# EAGLE schematic ide-8bit (EAGLE 9.4.2)

## Sheet 1 of 3: Bus interface
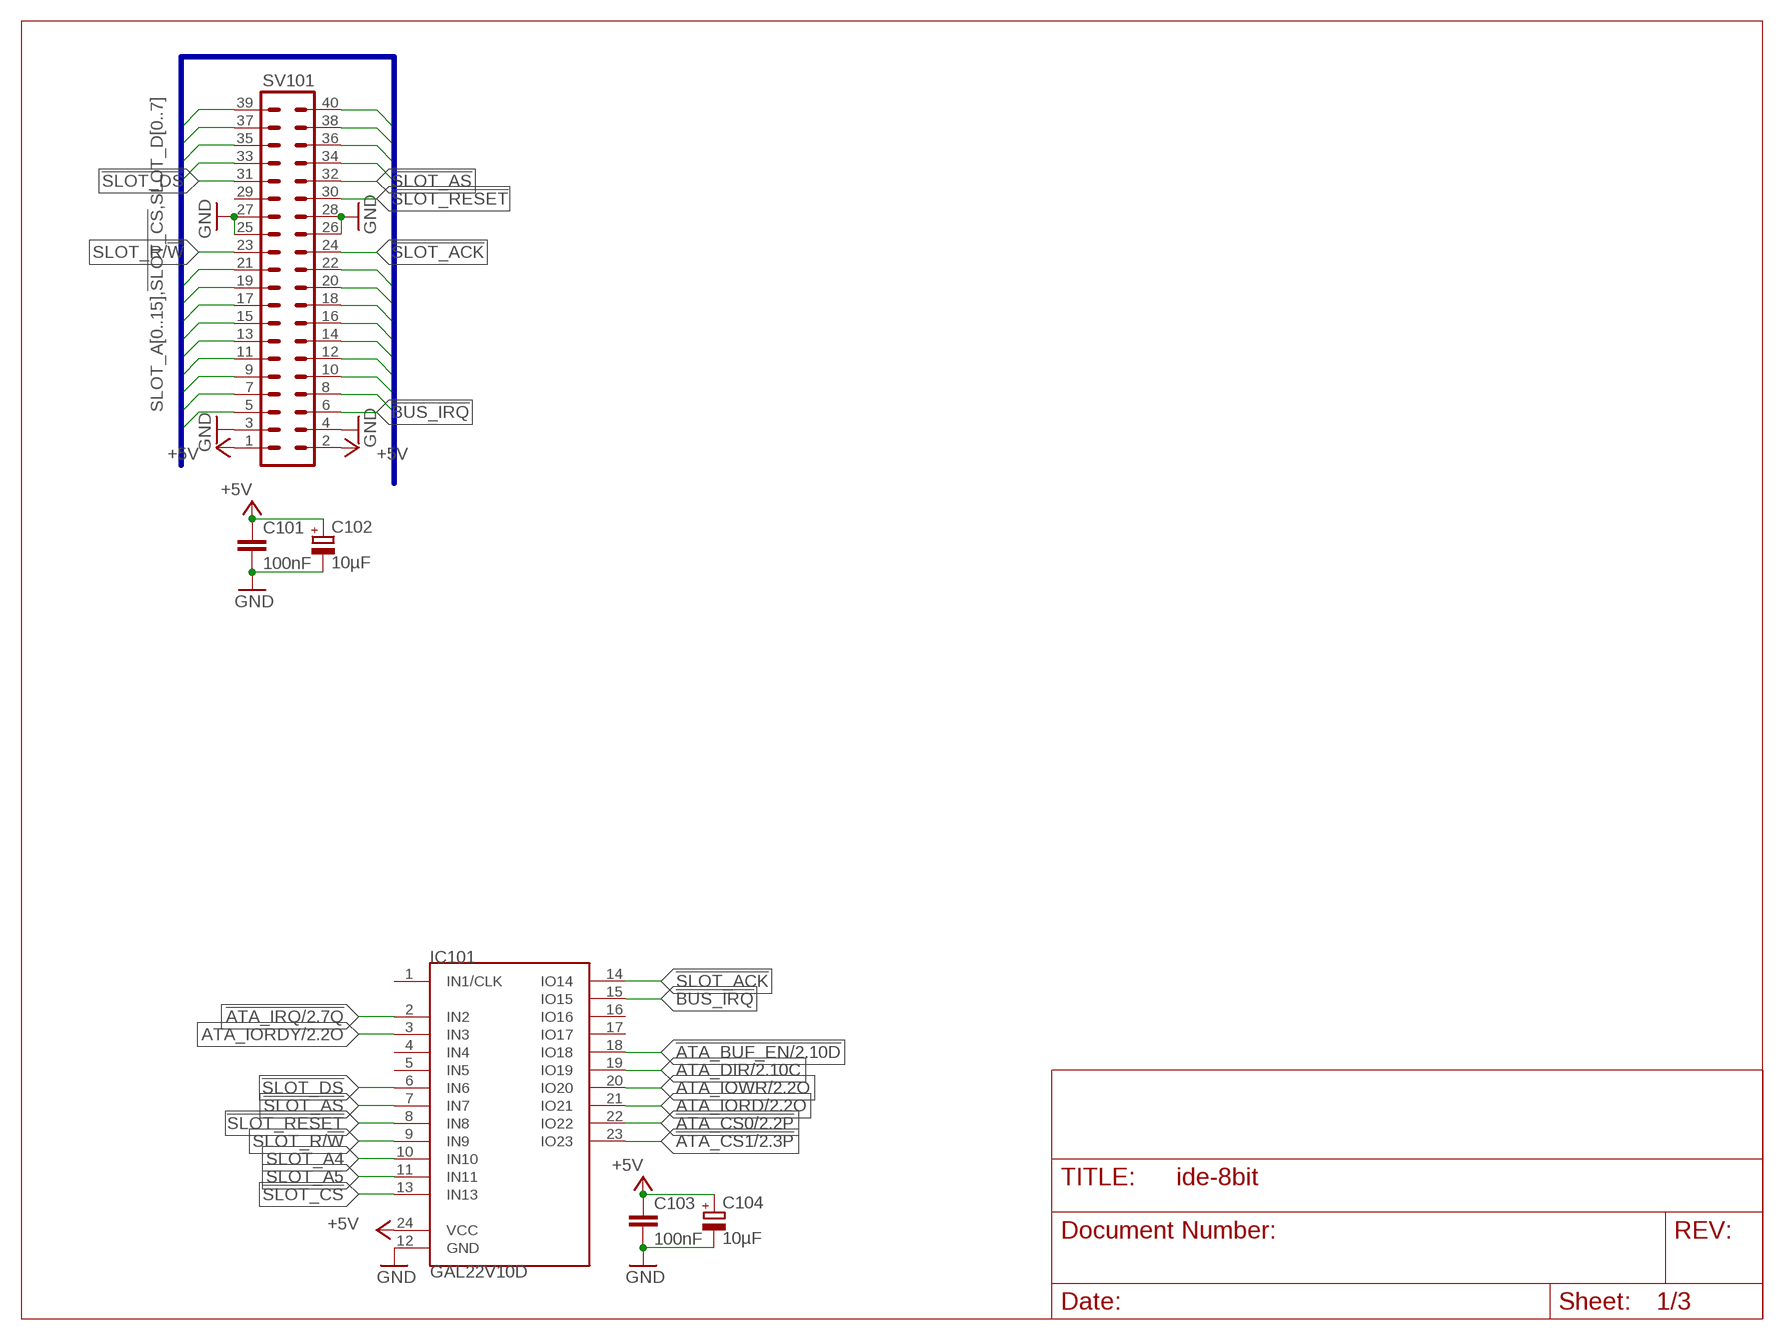
[diagram p0: schematic, sheet 1]

### Parts
C101  100nF  C-EUC0805  [C0805]
C102  10µF  CPOL-EUSMCB  [SMC_B]
C103  100nF  C-EUC0805  [C0805]
C104  10µF  CPOL-EUSMCB  [SMC_B]
IC101  GAL22V10D  GAL22V10DIP24  [DIL24S]
SV101  MA20-2W  [MA20-2W]

### Nets
!ATA_BUF_EN: IC101.18(IO18) ; also sheet 2
!ATA_CS0: IC101.22(IO22) ; also sheet 2
!ATA_CS1: IC101.23(IO23) ; also sheet 2
!ATA_IRQ: IC101.2(IN2) ; also sheet 2
!BUS_IRQ: IC101.15(IO15) SV101.6
!SLOT_ACK: IC101.14(IO14) SV101.24
!SLOT_AS: IC101.7(IN7) SV101.32
!SLOT_CS: IC101.13(IN13) SV101.5
!SLOT_DS: IC101.6(IN6) SV101.31
!SLOT_RESET: IC101.8(IN8) SV101.30
+5V: C101.1 C102.+ C103.1 C104.+ IC101.24(VCC) SV101.1 SV101.2 ; also sheet 2,3
ATA_DIR: IC101.19(IO19) ; also sheet 2
ATA_IORD: IC101.21(IO21) ; also sheet 2
ATA_IORDY: IC101.3(IN3) ; also sheet 2
ATA_IOWR: IC101.20(IO20) ; also sheet 2
GND: C101.2 C102.- C103.2 C104.- IC101.12(GND) SV101.3 SV101.4 SV101.25 SV101.26 SV101.27 SV101.28 ; also sheet 2,3
SLOT_A0: SV101.12 ; also sheet 2
SLOT_A1: SV101.10 ; also sheet 2
SLOT_A2: SV101.8 ; also sheet 2
SLOT_A3: SV101.7
SLOT_A4: IC101.10(IN10) SV101.9
SLOT_A5: IC101.11(IN11) SV101.11
SLOT_A6: SV101.14
SLOT_A7: SV101.13
SLOT_A8: SV101.16
SLOT_A9: SV101.15
SLOT_A10: SV101.18
SLOT_A11: SV101.17
SLOT_A12: SV101.20
SLOT_A13: SV101.19
SLOT_A14: SV101.22
SLOT_A15: SV101.21
SLOT_D0: SV101.35 ; also sheet 2
SLOT_D1: SV101.37 ; also sheet 2
SLOT_D2: SV101.39 ; also sheet 2
SLOT_D3: SV101.40 ; also sheet 2
SLOT_D4: SV101.38 ; also sheet 2
SLOT_D5: SV101.36 ; also sheet 2
SLOT_D6: SV101.34 ; also sheet 2
SLOT_D7: SV101.33 ; also sheet 2
SLOT_R/!W!: IC101.9(IN9) SV101.23
Unconnected: IC101.1(IN1/CLK) IC101.4(IN4) IC101.5(IN5) IC101.16(IO16) IC101.17(IO17) SV101.29

### Buses
SLOT_A[0..15],!SLOT_CS,SLOT_D[0..7]

## Sheet 2 of 3: ATA Interface
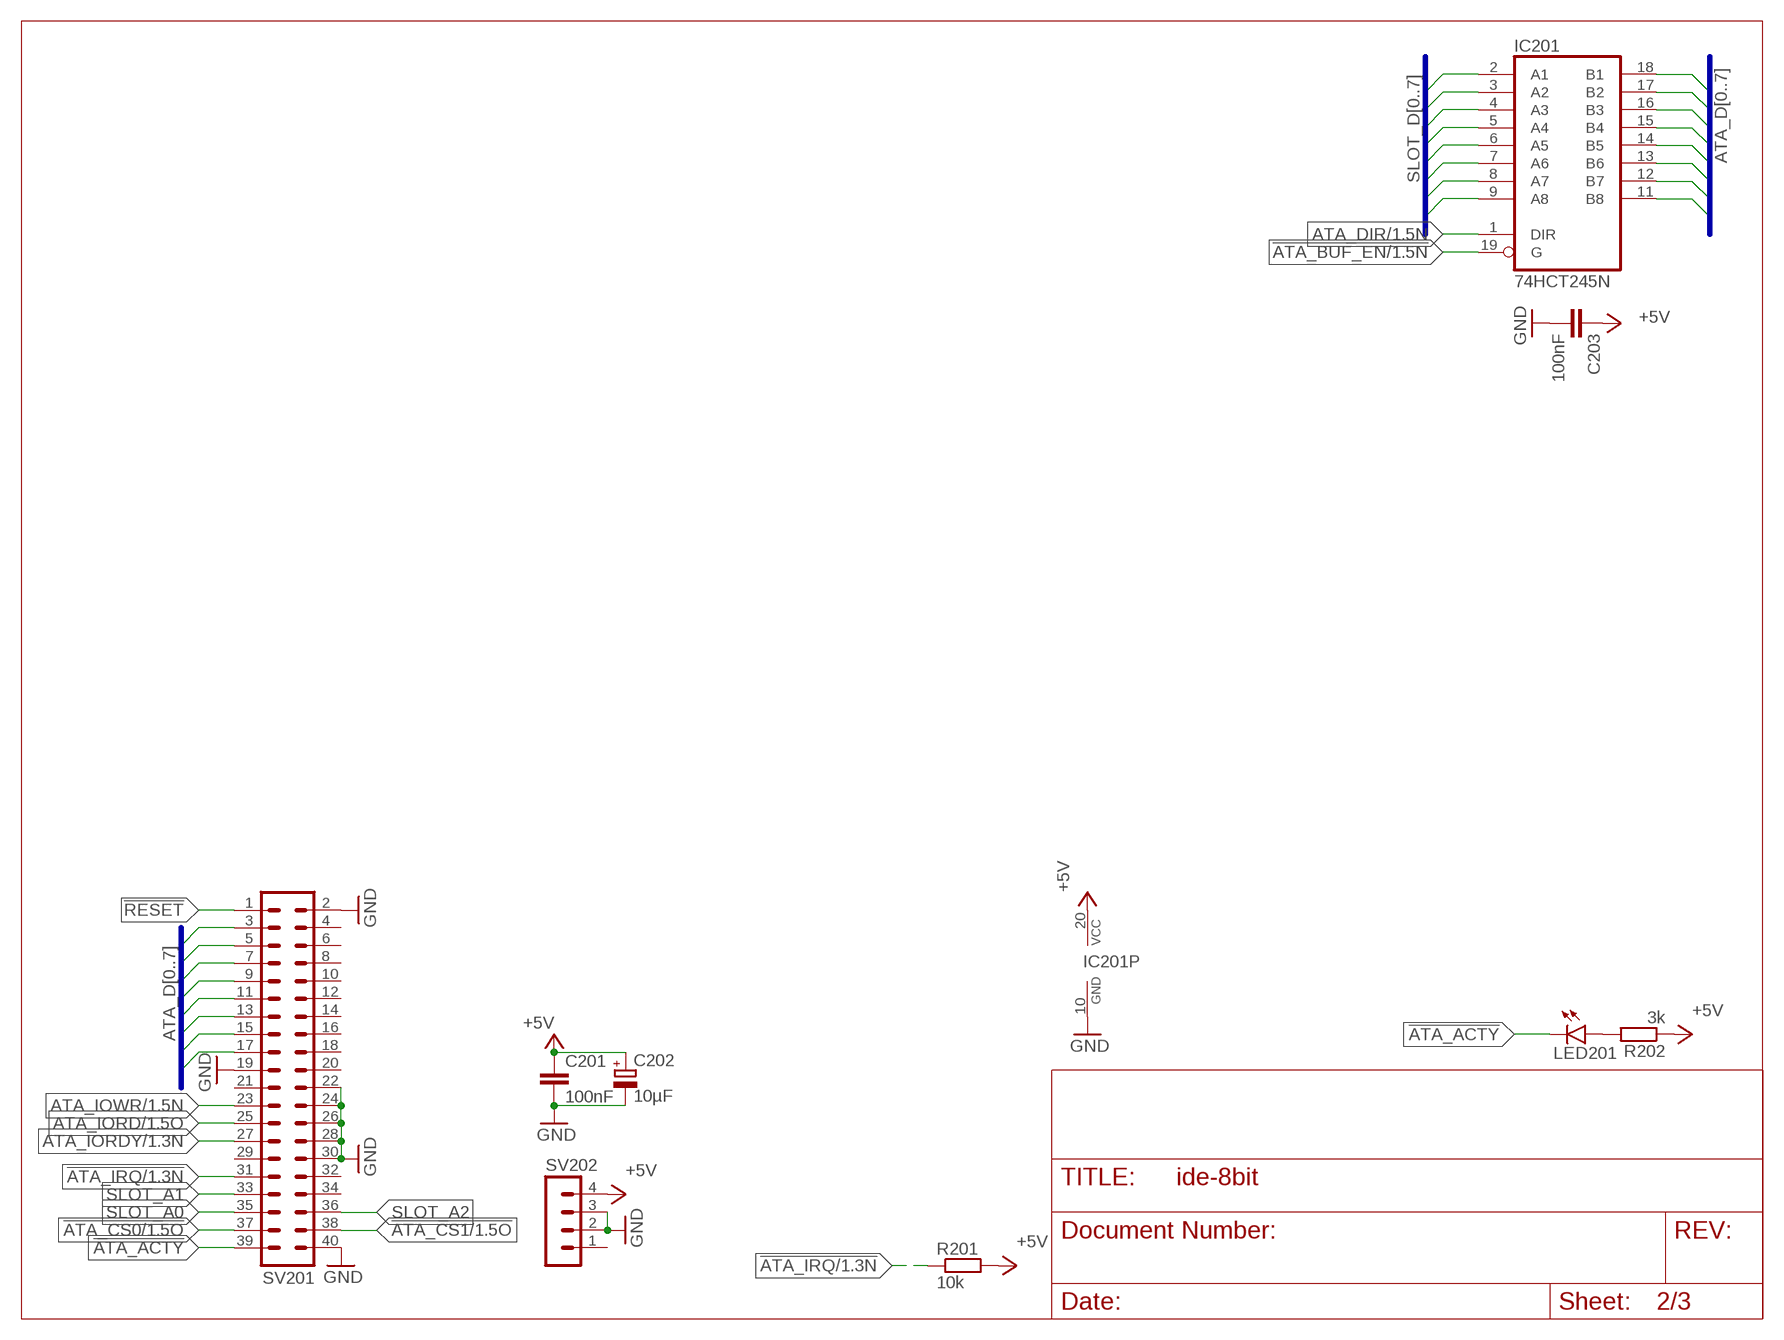
[diagram p1: schematic, sheet 2]

### Parts
C201  100nF  C-EUC0805  [C0805]
C202  10µF  CPOL-EUSMCB  [SMC_B]
C203  100nF  C-EUC0805  [C0805]
IC201  74HCT245N  [DIL20]
LED201  LEDCHIPLED_1206  [CHIPLED_1206]
R201  10k  R-EU_R2012  [R2012]
R202  3k  R-EU_R2012  [R2012]
SV201  ML40L  [ML40L]
SV202  MA04-1  [MA04-1]

### Nets
!ATA_ACTY: LED201.C SV201.39
!ATA_BUF_EN: IC201.19(G) ; also sheet 1
!ATA_CS0: SV201.37 ; also sheet 1
!ATA_CS1: SV201.38 ; also sheet 1
!ATA_IRQ: R201.1 SV201.31 ; also sheet 1
!RESET: SV201.1
+5V: C201.1 C202.+ C203.1 IC201.20(VCC) R201.2 R202.1 SV202.4 ; also sheet 1,3
ATA_D0: IC201.18(B1) SV201.17
ATA_D1: IC201.17(B2) SV201.15
ATA_D2: IC201.16(B3) SV201.13
ATA_D3: IC201.15(B4) SV201.11
ATA_D4: IC201.14(B5) SV201.9
ATA_D5: IC201.13(B6) SV201.7
ATA_D6: IC201.12(B7) SV201.5
ATA_D7: IC201.11(B8) SV201.3
ATA_DIR: IC201.1(DIR) ; also sheet 1
ATA_IORD: SV201.25 ; also sheet 1
ATA_IORDY: SV201.27 ; also sheet 1
ATA_IOWR: SV201.23 ; also sheet 1
GND: C201.2 C202.- C203.2 IC201.10(GND) SV201.2 SV201.19 SV201.22 SV201.24 SV201.26 SV201.28 SV201.30 SV201.40 SV202.2 SV202.3 ; also sheet 1,3
N$7: LED201.A R202.2
SLOT_A0: SV201.35 ; also sheet 1
SLOT_A1: SV201.33 ; also sheet 1
SLOT_A2: SV201.36 ; also sheet 1
SLOT_D0: IC201.2(A1) ; also sheet 1
SLOT_D1: IC201.3(A2) ; also sheet 1
SLOT_D2: IC201.4(A3) ; also sheet 1
SLOT_D3: IC201.5(A4) ; also sheet 1
SLOT_D4: IC201.6(A5) ; also sheet 1
SLOT_D5: IC201.7(A6) ; also sheet 1
SLOT_D6: IC201.8(A7) ; also sheet 1
SLOT_D7: IC201.9(A8) ; also sheet 1
Unconnected: SV201.4 SV201.6 SV201.8 SV201.10 SV201.12 SV201.14 SV201.16 SV201.18 SV201.20 SV201.21 SV201.29 SV201.32 SV201.34 SV202.1

### Buses
ATA_D[0..7]
SLOT_D[0..7]

## Sheet 3 of 3
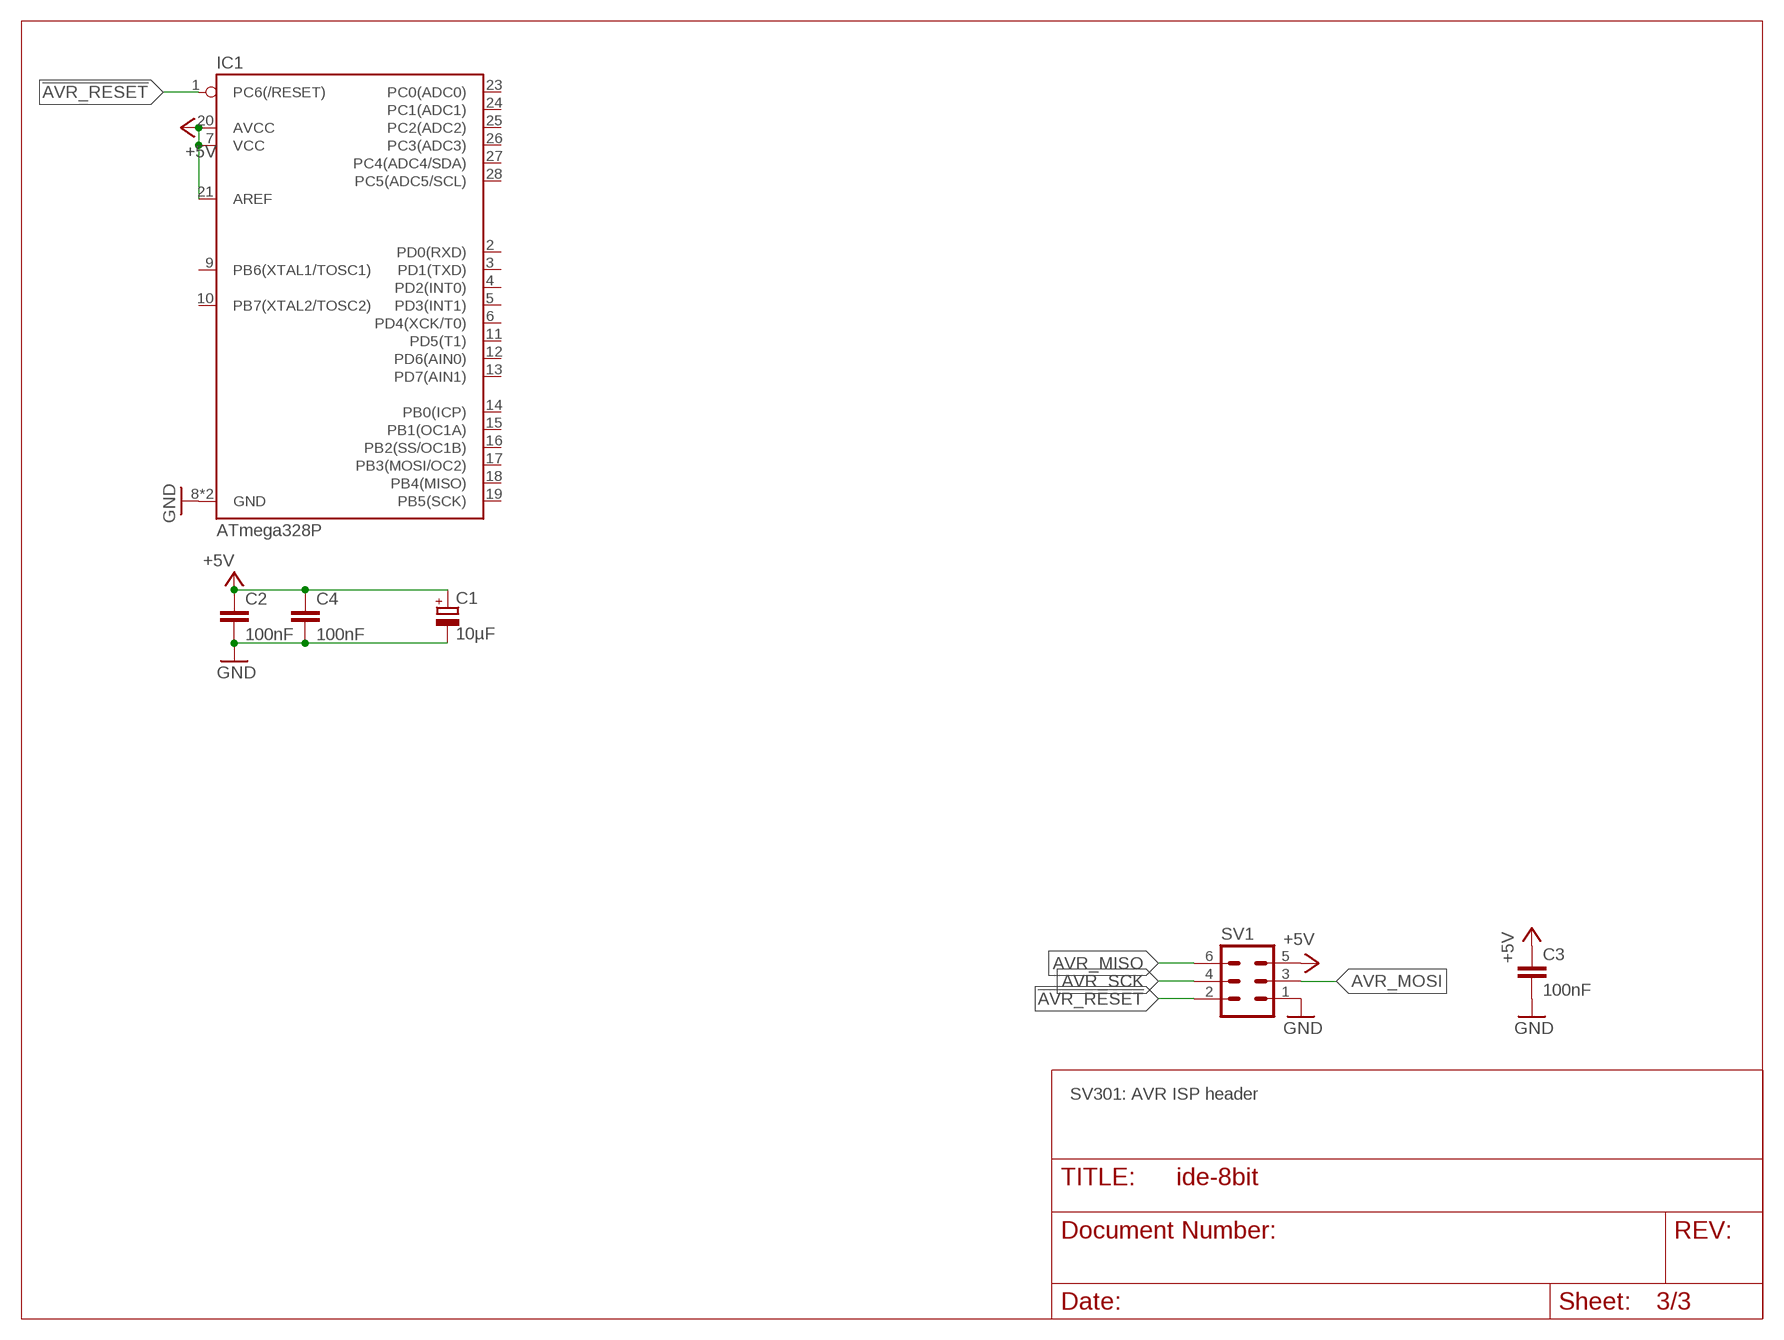
[diagram p2: schematic, sheet 3]

### Parts
C1  10µF  CPOL-EUSMCB  [SMC_B]
C2  100nF  C-EUC0805  [C0805]
C3  100nF  C-EUC0805  [C0805]
C4  100nF  C-EUC0805  [C0805]
IC1  ATmega328P  ATMEGA328P_PDIP  [DIP28]
SV1  ML6  [ML6]

### Nets
!AVR_RESET: IC1.1(PC6(/RESET)) SV1.2
+5V: C1.+ C2.1 C3.1 C4.1 IC1.7(VCC) IC1.20(AVCC) IC1.21(AREF) SV1.5 ; also sheet 1,2
AVR_MISO: SV1.6
AVR_MOSI: SV1.3
AVR_SCK: SV1.4
GND: C1.- C2.2 C3.2 C4.2 IC1.8(GND) IC1.22(GND) SV1.1 ; also sheet 1,2
Unconnected: IC1.2(PD0(RXD)) IC1.3(PD1(TXD)) IC1.4(PD2(INT0)) IC1.5(PD3(INT1)) IC1.6(PD4(XCK/T0)) IC1.9(PB6(XTAL1/TOSC1)) IC1.10(PB7(XTAL2/TOSC2)) IC1.11(PD5(T1)) IC1.12(PD6(AIN0)) IC1.13(PD7(AIN1)) IC1.14(PB0(ICP)) IC1.15(PB1(OC1A)) IC1.16(PB2(SS/OC1B)) IC1.17(PB3(MOSI/OC2)) IC1.18(PB4(MISO)) IC1.19(PB5(SCK)) IC1.23(PC0(ADC0)) IC1.24(PC1(ADC1)) IC1.25(PC2(ADC2)) IC1.26(PC3(ADC3)) IC1.27(PC4(ADC4/SDA)) IC1.28(PC5(ADC5/SCL))

### Notes on the sheet
- SV301: AVR ISP header

## Library data of the parts
C1 C102 C104 C202 = rcl:CPOL-EU: POLARIZED CAPACITOR, European symbol; MOUSER: 581-TAJB106K020RNJV; SPICEPREFIX: C
C2-C4 C101 C103 C201 C203 = rcl:C-EU: CAPACITOR, European symbol; MOUSER: 710-885012207072; SPICEPREFIX: C
IC1 = SparkFun-IC-Microcontroller:ATMEGA328P_PDIP: Atmel 328P Through hole ATMEGA328P uC used in the Arduino 32kb flash, 1k EEPROM, 2k SRAM Datasheet <http://www.sparkfun.com/datasheets/Components/SMD/ATMega328.pdf> SparkFun Products Storefront component: AVR 28 Pin 20MHz 32K 6A/D - ATMega328P <https://www.sparkfun.com/products/9061> (COM-09061) SparkFun Simon Says - Through-Hole Soldering Kit <https://www.sparkfun.com/products/10547> (KIT-10547) SparkFun Learn to Solder - Simon Says <https://www.sparkfun.com/products/13708> (KIT-13708) SparkFun BigTime Watch Kit <https://www.sparkfun.com/products/11734> (KIT-11734) SparkFun ClockIt <https://www.sparkfun.com/products/10930> (KIT-10930) SparkFun Serial Enabled LCD Kit <https://www.sparkfun.com/products/10097> (LCD-10097) SparkFun Simon Tilts - Through Hole Soldering Kit <https://www.sparkfun.com/products/12634> (KIT-12634) SparkFun Frequency Counter Kit <https://www.sparkfun.com/products/10140> (KIT-10140) FabFM Radio Kit <https://www.sparkfun.com/products/11043> (KIT-11043) SparkFun Binary Blaster Kit <https://www.sparkfun.com/products/12037> (KIT-12037) SparkFun Metro-Gnome <https://www.sparkfun.com/products/9236> (KIT-09236) ATmega328 with Arduino Optiboot (Uno) <https://www.sparkfun.com/products/10524> (DEV-10524); MOUSER: 556-ATMEGA328-PU; PROD_ID: IC-09136; VALUE: 328P
IC101 = 68komputer:GAL22V10: GAL22V10D – Generic Array Logic Datasheet <http://web.mit.edu/6.115/www/document/gal22v10.pdf>; MOUSER_SOCKET: 575-11044324
IC201 = 74xx-eu:74*245: Octal BUS TRANSCEIVER, 3-state; MOUSER: 595-SN74HCT245N; MOUSER_SOCKET: 575-1104732041001000
LED201 = led:LED: LED OSRAM: - CHIPLED LG R971, LG N971, LY N971, LG Q971, LY Q971, LO R971, LY R971 LH N974, LH R974 LS Q976, LO Q976, LY Q976 LO Q996 - Hyper CHIPLED LW Q18S LB Q993, LB Q99A, LB R99A - SideLED LS A670, LO A670, LY A670, LG A670, LP A670 LB A673, LV A673, LT A673, LW A673 LH A674 LY A675 LS A676, LA A676, LO A676, LY A676, LW A676 LS A679, LY A679, LG A679 - Hyper Micro SIDELED® LS Y876, LA Y876, LO Y876, LY Y876 LT Y87S - SmartLED LW L88C, LW L88S LB L89C, LB L89S, LG L890 LS L89K, LO L89K, LY L89K LS L896, LA L896, LO L896, LY L896 - TOPLED LS T670, LO T670, LY T670, LG T670, LP T670 LSG T670, LSP T670, LSY T670, LOP T670, LYG T670 LG T671, LOG T671, LSG T671 LB T673, LV T673, LT T673, LW T673 LH T674 LS T676, LA T676, LO T676, LY T676, LB T676, LH T676, LSB T676, LW T676 LB T67C, LV T67C, LT T67C, LS T67K, LO T67K, LY T67K, LW E67C LS E67B, LA E67B, LO E67B, LY E67B, LB E67C, LV E67C, LT E67C LW T67C LS T679, LY T679, LG T679 LS T770, LO T770, LY T770, LG T770, LP T770 LB T773, LV T773, LT T773, LW T773 LH T774 LS E675, LA E675, LY E675, LS T675 LS T776, LA T776, LO T776, LY T776, LB T776 LHGB T686 LT T68C, LB T68C - Hyper Mini TOPLED® LB M676 - Mini TOPLED Santana® LG M470 LS M47K, LO M47K, LY M47K Source: http://www.osram.convergy.de LUXEON: - LUMILED® LXK2-PW12-R00, LXK2-PW12-S00, LXK2-PW14-U00, LXK2-PW14-V00 LXK2-PM12-R00, LXK2-PM12-S00, LXK2-PM14-U00 LXK2-PE12-Q00, LXK2-PE12-R00, LXK2-PE12-S00, LXK2-PE14-T00, LXK2-PE14-U00 LXK2-PB12-K00, LXK2-PB12-L00, LXK2-PB12-M00, LXK2-PB14-N00, LXK2-PB14-P00, LXK2-PB14-Q00 LXK2-PR12-L00, LXK2-PR12-M00, LXK2-PR14-Q00, LXK2-PR14-R00 LXK2-PD12-Q00, LXK2-PD12-R00, LXK2-PD12-S00 LXK2-PH12-R00, LXK2-PH12-S00 LXK2-PL12-P00, LXK2-PL12-Q00, LXK2-PL12-R00 Source: www.luxeon.com KINGBRIGHT: KA-3528ASYC Source: www.kingbright.com; MOUSER: 710-156120VS75300
R201 = rcl:R-EU_: RESISTOR, European symbol; MOUSER: 652-CR0805FX-1002ELF; SPICEPREFIX: R
R202 = rcl:R-EU_: RESISTOR, European symbol; MOUSER: 652-CR0805JW-302ELF; SPICEPREFIX: R
SV1 = con-harting-ml:ML6: HARTING; OC_FARNELL: unknown; OC_NEWARK: unknown
SV101 = con-lstb:MA20-2W: PIN HEADER; MOUSER: 517-30340-5002; OC_FARNELL: unknown; OC_NEWARK: unknown
SV201 = con-harting-ml:ML40: HARTING; OC_FARNELL: unknown; OC_NEWARK: unknown
SV202 = con-lstb:MA04-1: PIN HEADER; OC_FARNELL: unknown; OC_NEWARK: unknown

## Net classes
0 default: width 0.203 mm